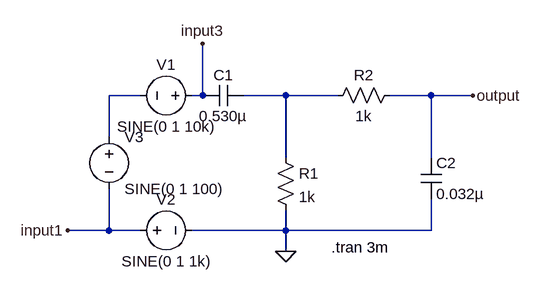
[diagram p0: schematic band-pass-analysis.asc]
band-pass-analysis.asc, the LTspice schematic file:
Version 4
SHEET 1 880 680
WIRE -16 32 -64 32
WIRE 80 32 80 -48
WIRE 80 32 64 32
WIRE 208 32 144 32
WIRE 288 32 208 32
WIRE 432 32 368 32
WIRE 496 32 432 32
WIRE -64 96 -64 32
WIRE 208 128 208 32
WIRE 432 128 432 32
WIRE -64 240 -64 176
WIRE -64 240 -128 240
WIRE -16 240 -64 240
WIRE 208 240 208 208
WIRE 208 240 64 240
WIRE 432 240 432 192
WIRE 432 240 208 240
WIRE 208 272 208 240
FLAG 208 272 0
FLAG 496 32 output
FLAG -128 240 input1
FLAG 80 -48 input3
SYMBOL cap 144 16 R90
WINDOW 0 0 32 VBottom 2
WINDOW 3 32 32 VTop 2
SYMATTR InstName C1
SYMATTR Value 0.530µ
SYMBOL res 192 112 R0
SYMATTR InstName R1
SYMATTR Value 1k
SYMBOL res 384 16 R90
WINDOW 0 0 56 VBottom 2
WINDOW 3 32 56 VTop 2
SYMATTR InstName R2
SYMATTR Value 1k
SYMBOL cap 416 128 R0
SYMATTR InstName C2
SYMATTR Value 0.032µ
SYMBOL voltage 80 32 R90
WINDOW 0 -32 56 VBottom 2
WINDOW 3 32 56 VTop 2
WINDOW 123 0 0 Left 0
WINDOW 39 0 0 Left 0
SYMATTR InstName V1
SYMATTR Value SINE(0 1 10k)
SYMBOL voltage -32 240 R270
WINDOW 0 32 56 VTop 2
WINDOW 3 -32 56 VBottom 2
WINDOW 123 0 0 Left 0
WINDOW 39 0 0 Left 0
SYMATTR InstName V2
SYMATTR Value SINE(0 1 1k)
SYMBOL voltage -64 80 R0
WINDOW 123 0 0 Left 0
WINDOW 39 0 0 Left 0
SYMATTR InstName V3
SYMATTR Value SINE(0 1 100)
TEXT 278 266 Left 2 !.tran 3m

The netlist it stands for:
* band-pass-analysis.asc
C1 N002 input3 0.530µ
R1 N002 0 1k
R2 output N002 1k
C2 output 0 0.032µ
V1 input3 N001 SINE(0 1 10k)
V2 input1 0 SINE(0 1 1k)
V3 N001 input1 SINE(0 1 100)
.tran 3m
.backanno
.end

* Results of the author's LTspice run, read from the files saved beside the schematic
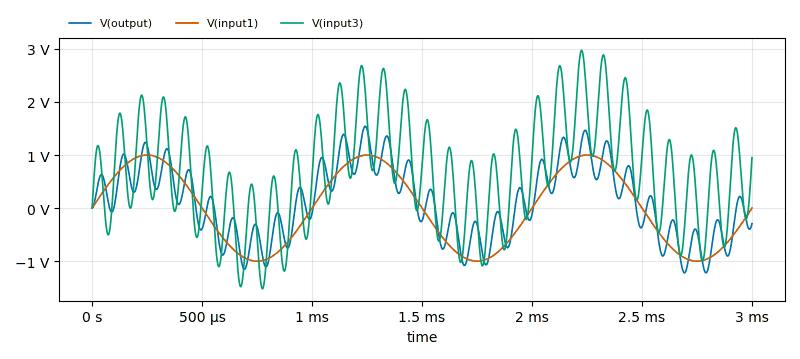
[diagram p1: Transient Analysis of band-pass-analysis.asc, plotted from the saved traces]
* Transient Analysis, 1 run:
*   V(output): min -1.221 V, max 1.542 V, average 118.8 mV, rms 699.5 mV, last -292.3 mV
*   V(input1): min -1 V, max 1 V, average 0 V, rms 707.1 mV, last 0 V
*   V(input3): min -1.52 V, max 2.971 V, average 694.5 mV, rms 1.211 V, last 951.1 mV